# Altium schematic sheet rs485.SchDoc
size D
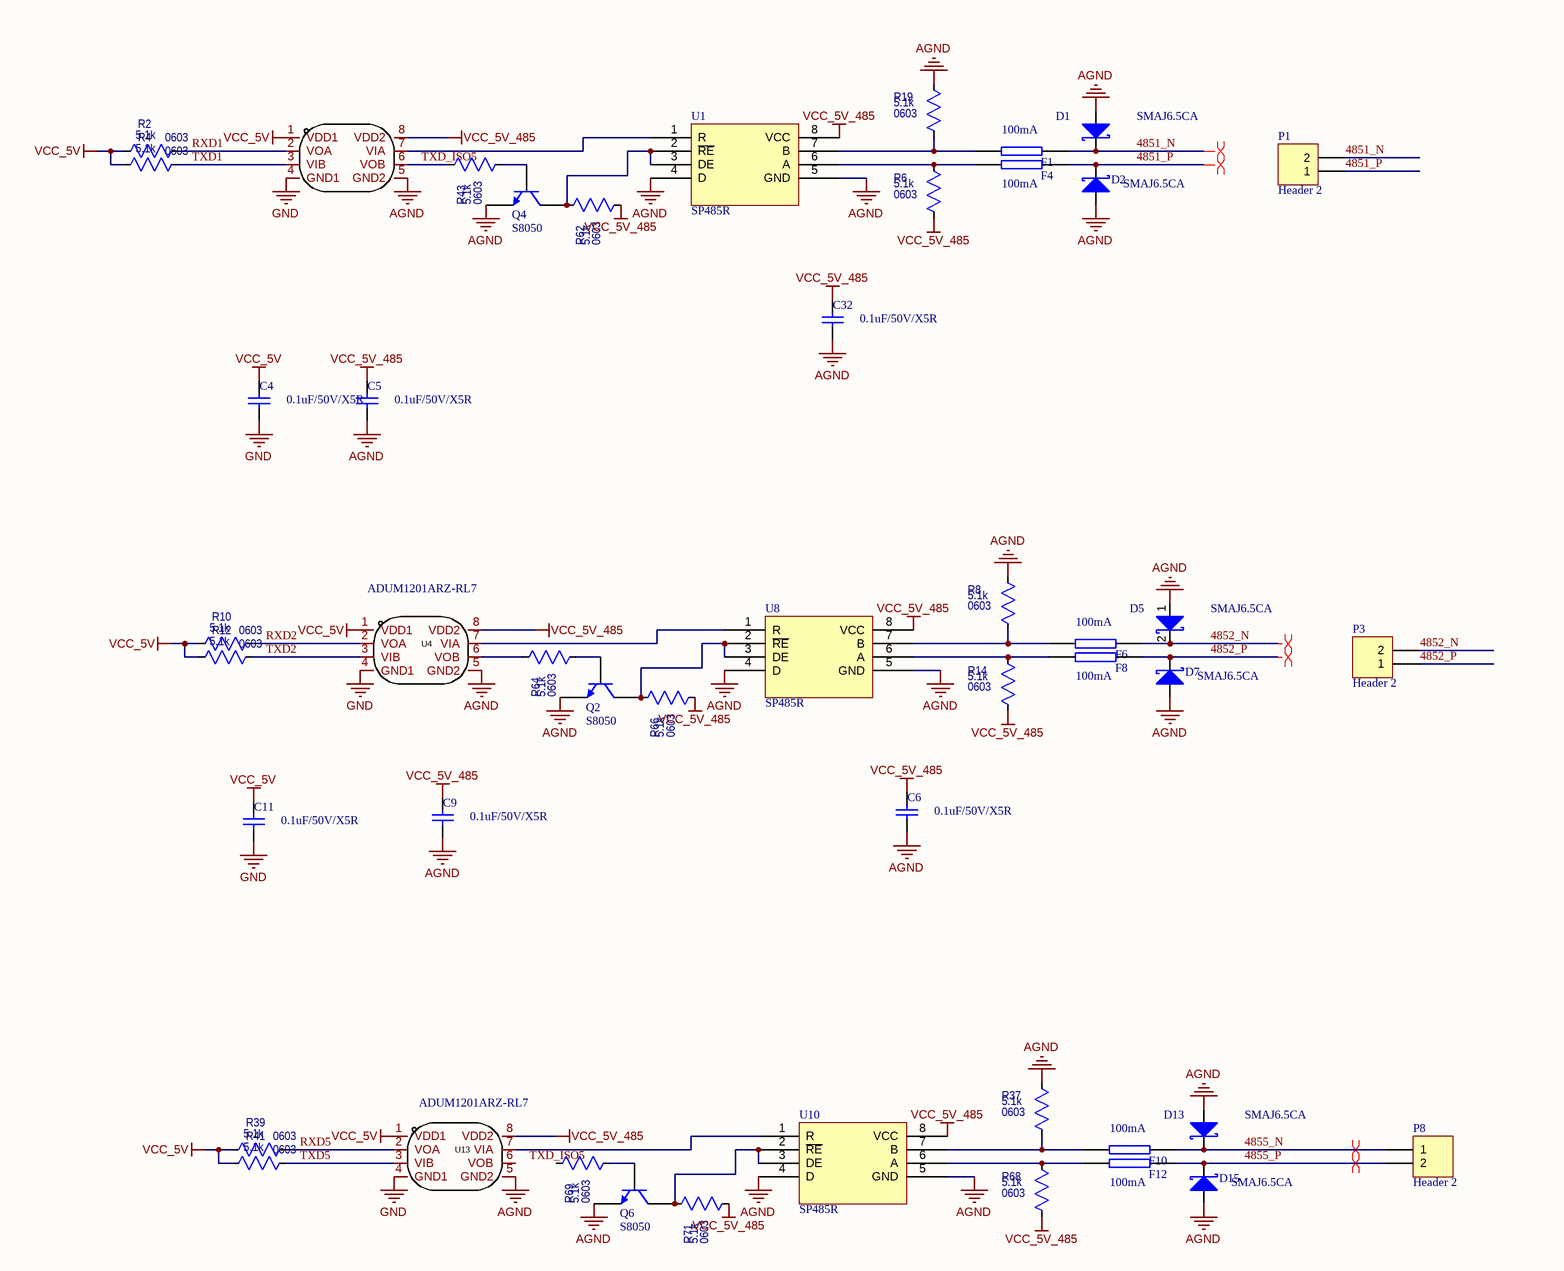
[diagram p0: rs485.SchDoc, top left]
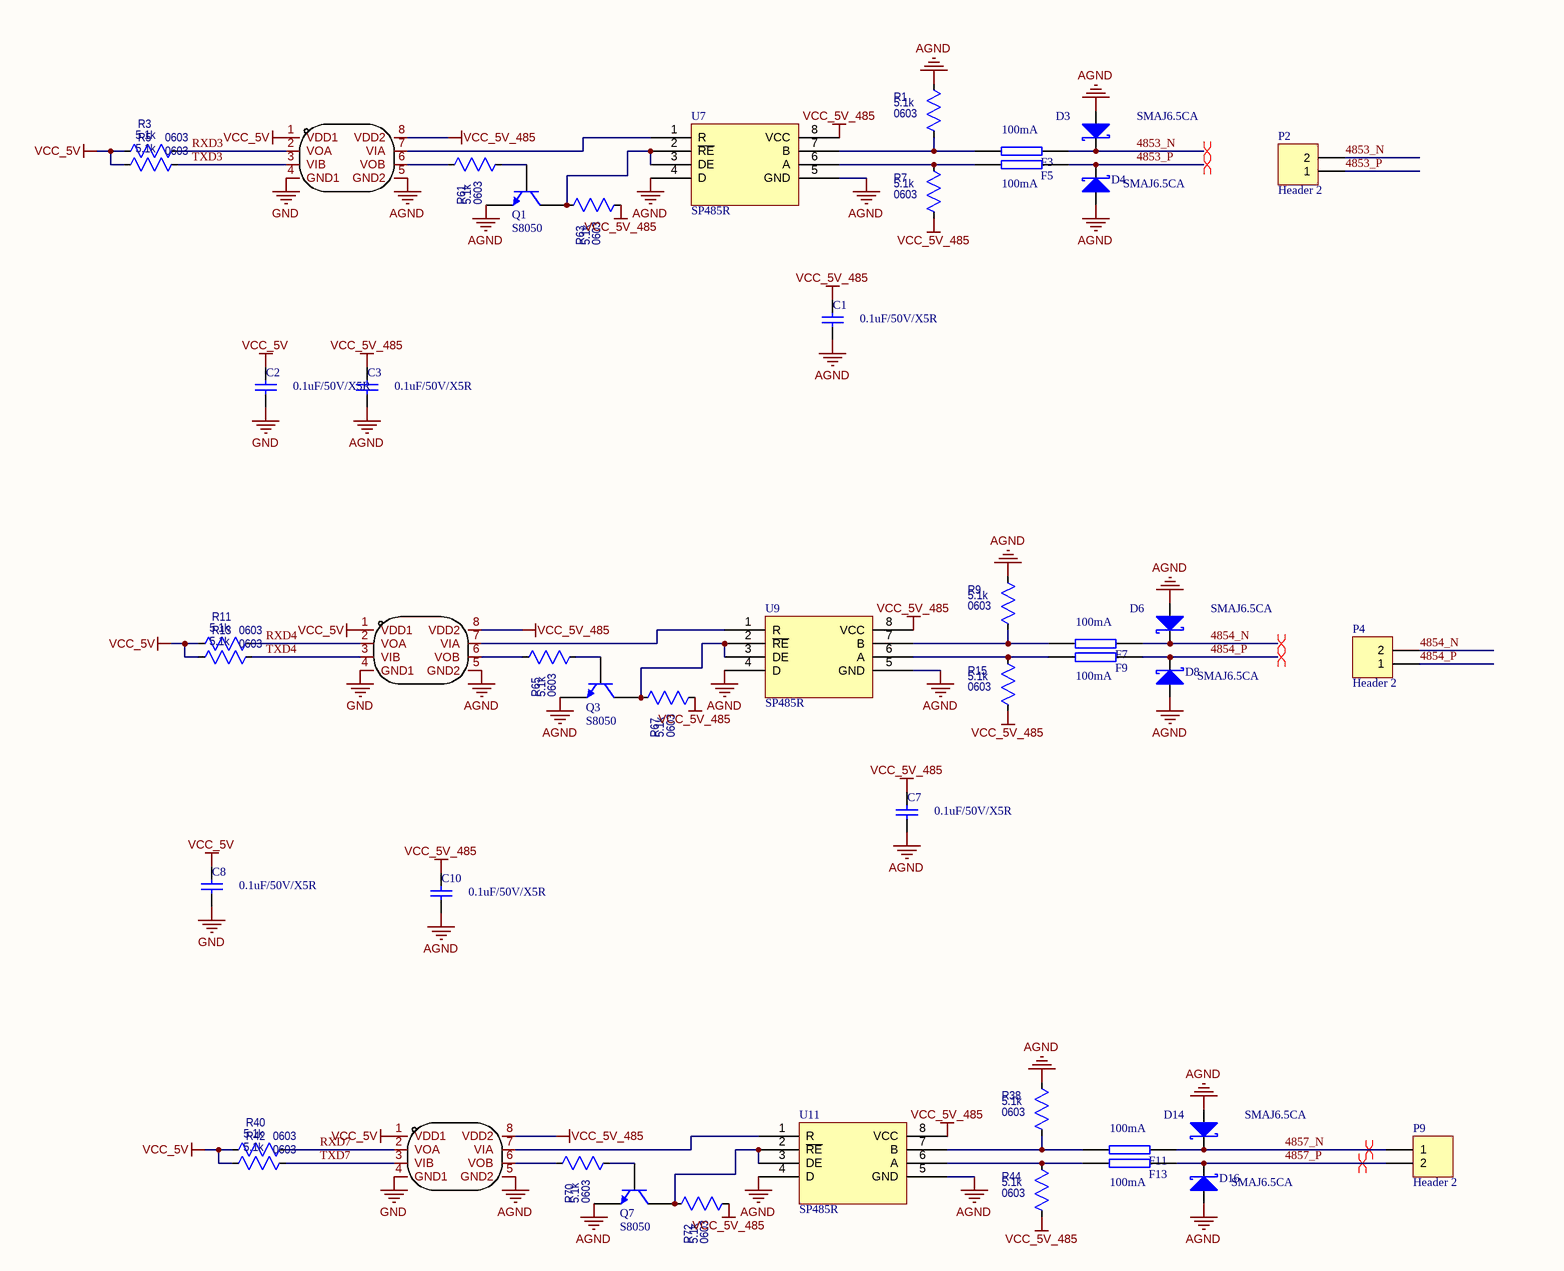
[diagram p1: rs485.SchDoc, top right]
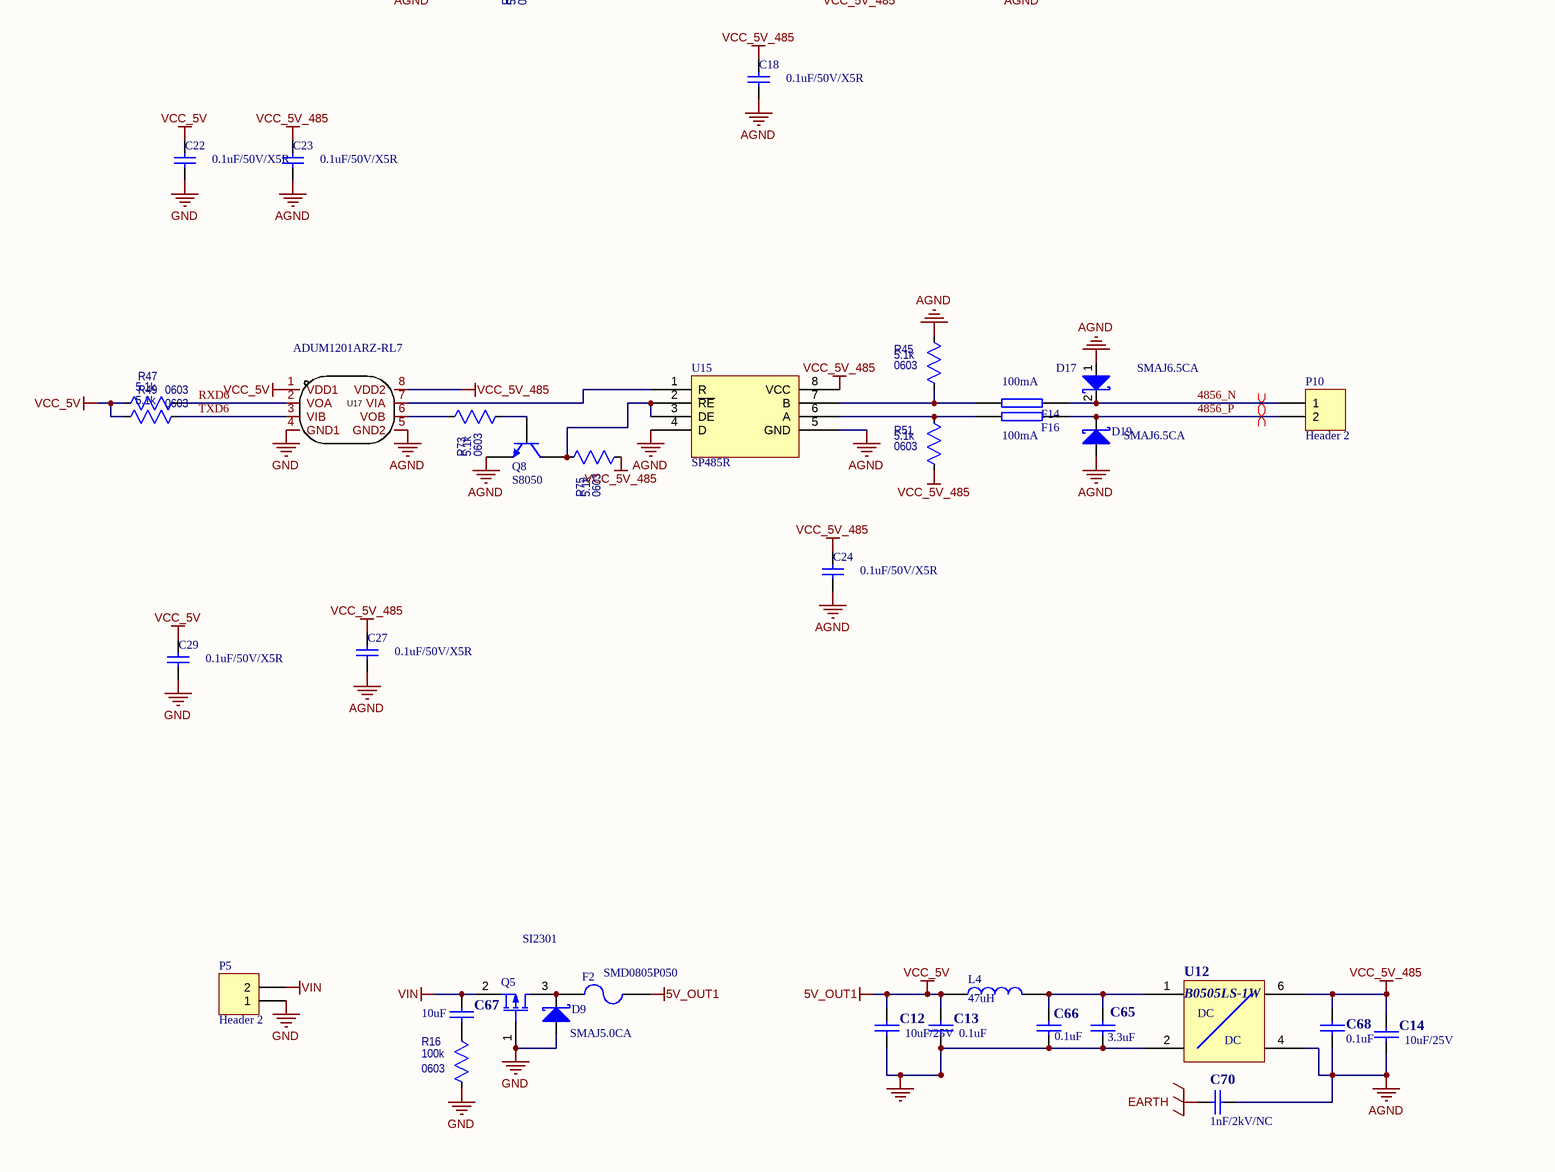
[diagram p2: rs485.SchDoc, bottom left]
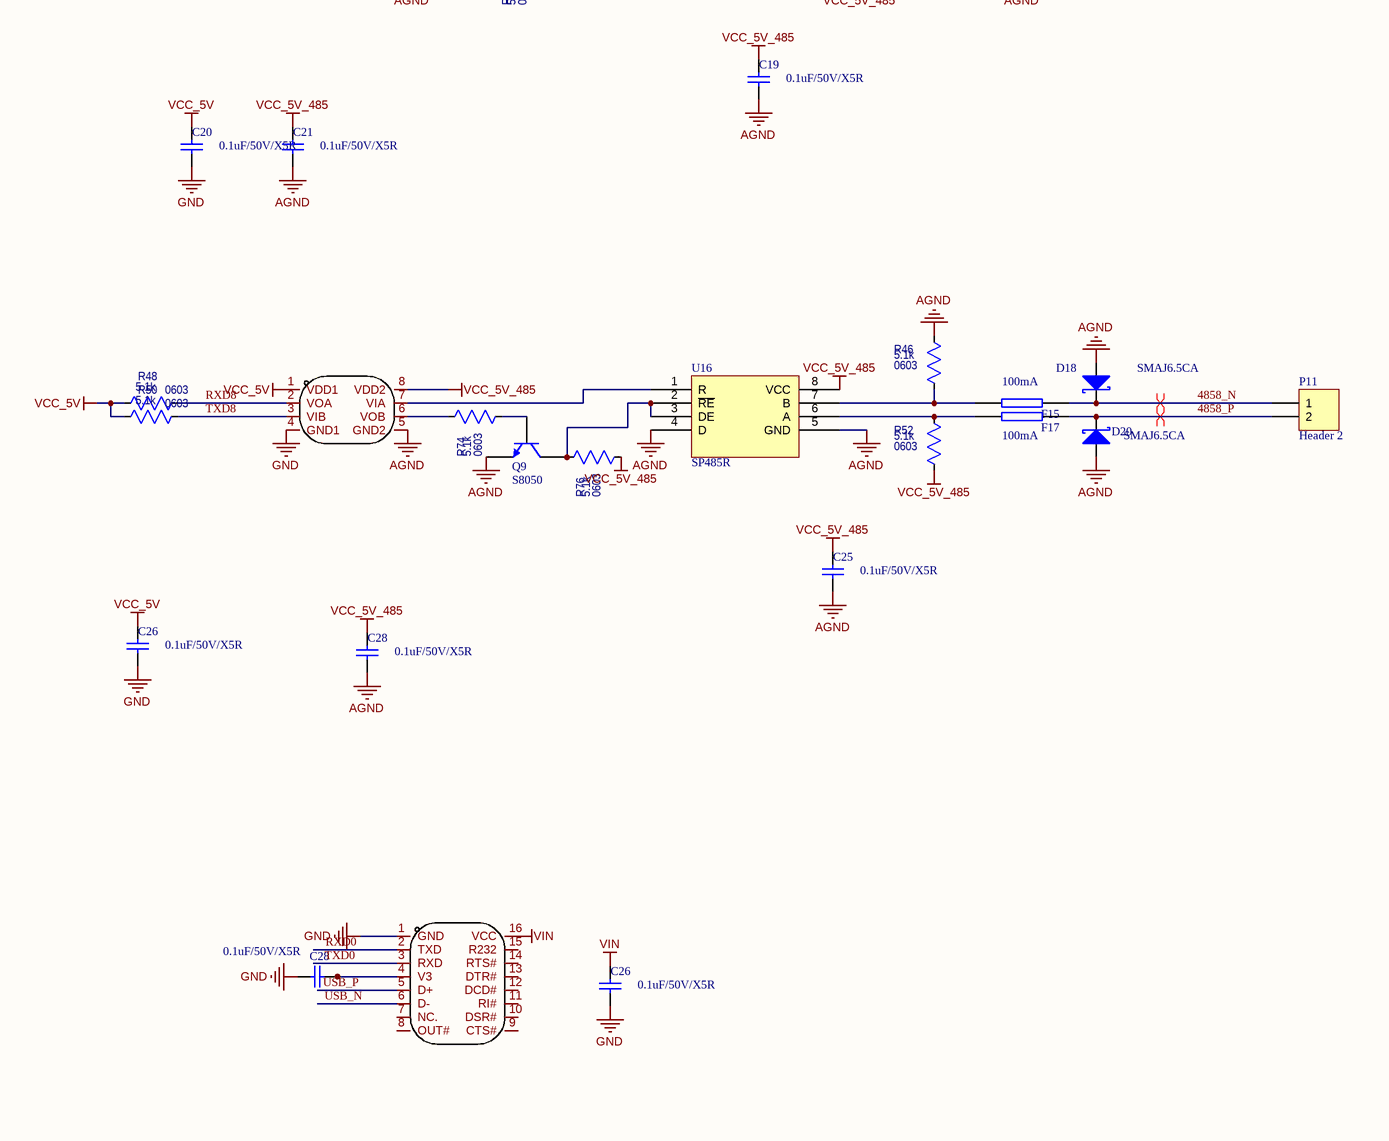
[diagram p3: rs485.SchDoc, bottom right]

## Parts
(Parts that share a designator on the sheet are numbered #1, #2 ... from top to bottom, then left to right.)
C1  0.1uF/50V/X5R  [0603C]
C2  0.1uF/50V/X5R  [0603C]
C3  0.1uF/50V/X5R  [0603C]
C4  0.1uF/50V/X5R  [0603C]
C5  0.1uF/50V/X5R  [0603C]
C6  0.1uF/50V/X5R  [0603C]
C7  0.1uF/50V/X5R  [0603C]
C8  0.1uF/50V/X5R  [0603C]
C9  0.1uF/50V/X5R  [0603C]
C10  0.1uF/50V/X5R  [0603C]
C11  0.1uF/50V/X5R  [0603C]
C12  10uF/25V  [0805C]
C13  0.1uF  [0603C]
C14  10uF/25V  [0805C]
C18  0.1uF/50V/X5R  [0603C]
C19  0.1uF/50V/X5R  [0603C]
C20  0.1uF/50V/X5R  [0603C]
C21  0.1uF/50V/X5R  [0603C]
C22  0.1uF/50V/X5R  [0603C]
C23  0.1uF/50V/X5R  [0603C]
C24  0.1uF/50V/X5R  [0603C]
C25  0.1uF/50V/X5R  [0603C]
C26#1  0.1uF/50V/X5R  [0603C]
C26#2  0.1uF/50V/X5R  [0603C]
C27  0.1uF/50V/X5R  [0603C]
C28#1  0.1uF/50V/X5R  [0603C]
C28#2  0.1uF/50V/X5R  [0603C]
C29  0.1uF/50V/X5R  [0603C]
C32  0.1uF/50V/X5R  [0603C]
C65  3.3uF  [0805C]
C66  0.1uF  [0603C]
C67  10uF  [0603C]
C68  0.1uF  [0603C]
C70  1nF/2kV/NC  [1206C]
D1  SMAJ6.5CA  [SMA]
D2  SMAJ6.5CA  [SMA]
D3  SMAJ6.5CA  [SMA]
D4  SMAJ6.5CA  [SMA]
D5  SMAJ6.5CA  [SMA]
D6  SMAJ6.5CA  [SMA]
D7  SMAJ6.5CA  [SMA]
D8  SMAJ6.5CA  [SMA]
D9  SMAJ5.0CA  [SMA]
D13  SMAJ6.5CA  [SMA]
D14  SMAJ6.5CA  [SMA]
D15  SMAJ6.5CA  [SMA]
D16  SMAJ6.5CA  [SMA]
D17  SMAJ6.5CA  [SMA]
D18  SMAJ6.5CA  [SMA]
D19  SMAJ6.5CA  [SMA]
D20  SMAJ6.5CA  [SMA]
F1  100mA  [0805R]
F2  SMD0805P050  [0805R]
F3  100mA  [0805R]
F4  100mA  [0805R]
F5  100mA  [0805R]
F6  100mA  [0805R]
F7  100mA  [0805R]
F8  100mA  [0805R]
F9  100mA  [0805R]
F10  100mA  [0805R]
F11  100mA  [0805R]
F12  100mA  [0805R]
F13  100mA  [0805R]
F14  100mA  [0805R]
F15  100mA  [0805R]
F16  100mA  [0805R]
F17  100mA  [0805R]
L4  47uH  [IND-SMD_L7.0-W6.6_FXL0630]
P1  Header 2  [HDR1X2]
P2  Header 2  [HDR1X2]
P3  Header 2  [HDR1X2]
P4  Header 2  [HDR1X2]
P5  Header 2  [HDR1X2]
P8  Header 2  [HDR1X2]
P9  Header 2  [HDR1X2]
P10  Header 2  [HDR1X2]
P11  Header 2  [HDR1X2]
Q1  S8050  [SOT23-3]
Q2  S8050  [SOT23-3]
Q3  S8050  [SOT23-3]
Q4  S8050  [SOT23-3]
Q5  SI2301  [sot23-3]
Q6  S8050  [SOT23-3]
Q7  S8050  [SOT23-3]
Q8  S8050  [SOT23-3]
Q9  S8050  [SOT23-3]
R1  value 5.1k  Package: 0603  [0603r]  (hidden comment: 10k)
R2  value 5.1k  Package: 0603  [0603r]  (hidden comment: 10k)
R3  value 5.1k  Package: 0603  [0603r]  (hidden comment: 10k)
R4  value 5.1k  Package: 0603  [0603r]  (hidden comment: 10k)
R5  value 5.1k  Package: 0603  [0603r]  (hidden comment: 10k)
R6  value 5.1k  Package: 0603  [0603r]  (hidden comment: 10k)
R7  value 5.1k  Package: 0603  [0603r]  (hidden comment: 10k)
R8  value 5.1k  Package: 0603  [0603r]  (hidden comment: 10k)
R9  value 5.1k  Package: 0603  [0603r]  (hidden comment: 10k)
R10  value 5.1k  Package: 0603  [0603r]  (hidden comment: 10k)
R11  value 5.1k  Package: 0603  [0603r]  (hidden comment: 10k)
R12  value 5.1k  Package: 0603  [0603r]  (hidden comment: 10k)
R13  value 5.1k  Package: 0603  [0603r]  (hidden comment: 10k)
R14  value 5.1k  Package: 0603  [0603r]  (hidden comment: 10k)
R15  value 5.1k  Package: 0603  [0603r]  (hidden comment: 10k)
R16  value 100k  Package: 0603  [0603r]  (hidden comment: 10k)
R19  value 5.1k  Package: 0603  [0603r]  (hidden comment: 10k)
R37  value 5.1k  Package: 0603  [0603r]  (hidden comment: 10k)
R38  value 5.1k  Package: 0603  [0603r]  (hidden comment: 10k)
R39  value 5.1k  Package: 0603  [0603r]  (hidden comment: 10k)
R40  value 5.1k  Package: 0603  [0603r]  (hidden comment: 10k)
R41  value 5.1k  Package: 0603  [0603r]  (hidden comment: 10k)
R42  value 5.1k  Package: 0603  [0603r]  (hidden comment: 10k)
R43  value 5.1k  Package: 0603  [0603r]  (hidden comment: 10k)
R44  value 5.1k  Package: 0603  [0603r]  (hidden comment: 10k)
R45  value 5.1k  Package: 0603  [0603r]  (hidden comment: 10k)
R46  value 5.1k  Package: 0603  [0603r]  (hidden comment: 10k)
R47  value 5.1k  Package: 0603  [0603r]  (hidden comment: 10k)
R48  value 5.1k  Package: 0603  [0603r]  (hidden comment: 10k)
R49  value 5.1k  Package: 0603  [0603r]  (hidden comment: 10k)
R50  value 5.1k  Package: 0603  [0603r]  (hidden comment: 10k)
R51  value 5.1k  Package: 0603  [0603r]  (hidden comment: 10k)
R52  value 5.1k  Package: 0603  [0603r]  (hidden comment: 10k)
R61  value 5.1k  Package: 0603  [0603r]  (hidden comment: 10k)
R62  value 5.1k  Package: 0603  [0603r]  (hidden comment: 10k)
R63  value 5.1k  Package: 0603  [0603r]  (hidden comment: 10k)
R64  value 5.1k  Package: 0603  [0603r]  (hidden comment: 10k)
R65  value 5.1k  Package: 0603  [0603r]  (hidden comment: 10k)
R66  value 5.1k  Package: 0603  [0603r]  (hidden comment: 10k)
R67  value 5.1k  Package: 0603  [0603r]  (hidden comment: 10k)
R68  value 5.1k  Package: 0603  [0603r]  (hidden comment: 10k)
R69  value 5.1k  Package: 0603  [0603r]  (hidden comment: 10k)
R70  value 5.1k  Package: 0603  [0603r]  (hidden comment: 10k)
R71  value 5.1k  Package: 0603  [0603r]  (hidden comment: 10k)
R72  value 5.1k  Package: 0603  [0603r]  (hidden comment: 10k)
R73  value 5.1k  Package: 0603  [0603r]  (hidden comment: 10k)
R74  value 5.1k  Package: 0603  [0603r]  (hidden comment: 10k)
R75  value 5.1k  Package: 0603  [0603r]  (hidden comment: 10k)
R76  value 5.1k  Package: 0603  [0603r]  (hidden comment: 10k)
U1  SP485R  [so-8]
U2  ADUM1201ARZ-RL7  [SO8]  (value not drawn)
U3  ADUM1201ARZ-RL7  [SO-8]  (value not drawn)
U4  ADUM1201ARZ-RL7  [SO-8]
U5  ADUM1201ARZ-RL7  [SO-8]  (value not drawn)
U7  SP485R  [so-8]
U8  SP485R  [so-8]
U9  SP485R  [so-8]
U10  SP485R  [so-8]
U11  SP485R  [so-8]
U12  B0505LS-1W  [PWRM-TH_4P-L19.7-W6.0-P2.54]
U13  ADUM1201ARZ-RL7  [SO-8]
U14  ADUM1201ARZ-RL7  [SO-8]  (value not drawn)
U15  SP485R  [so-8]
U16  SP485R  [so-8]
U17  ADUM1201ARZ-RL7  [SO-8]
U18  ADUM1201ARZ-RL7  [SO-8]  (value not drawn)
U?  CH340C  [SOP-16_L10.0-W3.9-P1.27-LS6.0-BL]  (value not drawn)

## Nets
5V_OUT1: C2.2 C4.2 C8.2 C11.2 C12.1 C13.1 C20.2 C22.2 C26#1.2 C29.2 F2.2 L4.1 R2.1 R3.1 R4.1 R5.1 R10.1 R11.1 R12.1 R13.1 R39.1 R40.1 R41.1 R42.1 R47.1 R48.1 R49.1 R50.1 U2.1(VDD1) U3.1(VDD1) U4.1(VDD1) U5.1(VDD1) U13.1(VDD1) U14.1(VDD1) U17.1(VDD1) U18.1(VDD1)  [also labelled VCC_5V]
AGND: C1.1 C3.1 C5.1 C6.1 C7.1 C9.1 C10.1 C14.2 C18.1 C19.1 C21.1 C23.1 C24.1 C25.1 C27.1 C28#1.1 C32.1 C68.2 C70.1 D1.1(A) D2.1(A) D3.1(A) D4.1(A) D5.1(A) D6.1(A) D7.1(A) D8.1(A) D13.1(A) D14.1(A) D15.1(A) D16.1(A) D17.1(A) D18.1(A) D19.1(A) D20.1(A) Q1.2(E) Q2.2(E) Q3.2(E) Q4.2(E) Q6.2(E) Q7.2(E) Q8.2(E) Q9.2(E) R1.1 R8.1 R9.1 R19.1 R37.1 R38.1 R45.1 R46.1 U1.4(D) U1.5(GND) U2.5(GND2) U3.5(GND2) U4.5(GND2) U5.5(GND2) U7.4(D) U7.5(GND) U8.4(D) U8.5(GND) U9.4(D) U9.5(GND) U10.4(D) U10.5(GND) U11.4(D) U11.5(GND) U12.4 U13.5(GND2) U14.5(GND2) U15.4(D) U15.5(GND) U16.4(D) U16.5(GND) U17.5(GND2) U18.5(GND2)
EARTH: C70.2
GND: C2.1 C4.1 C8.1 C11.1 C12.2 C13.2 C20.1 C22.1 C26#1.1 C26#2.1 C28#2.2 C29.1 C65.2 C66.2 D9.1(A) P5.1 Q5.1(G) R16.2 U2.4(GND1) U3.4(GND1) U4.4(GND1) U5.4(GND1) U12.2 U13.4(GND1) U14.4(GND1) U17.4(GND1) U18.4(GND1) U?.1(GND)
VCC_5V_485: C1.2 C3.2 C5.2 C6.2 C7.2 C9.2 C10.2 C14.1 C18.2 C19.2 C21.2 C23.2 C24.2 C25.2 C27.2 C28#1.2 C32.2 C68.1 R6.2 R7.2 R14.2 R15.2 R44.2 R51.2 R52.2 R62.2 R63.2 R66.2 R67.2 R68.2 R71.2 R72.2 R75.2 R76.2 U1.8(VCC) U2.8(VDD2) U3.8(VDD2) U4.8(VDD2) U5.8(VDD2) U7.8(VCC) U8.8(VCC) U9.8(VCC) U10.8(VCC) U11.8(VCC) U12.6 U13.8(VDD2) U14.8(VDD2) U15.8(VCC) U16.8(VCC) U17.8(VDD2) U18.8(VDD2)
VIN: C26#2.2 C67.1 P5.2 Q5.2(S) U?.16(VCC)
4851_N: D1.2(K) F1.1 P1.2
4851_P: D2.2(K) F4.1 P1.1
4852_N: D5.2(K) F6.1 P3.2
4852_P: D7.2(K) F8.1 P3.1
4853_N: D3.2(K) F3.1 P2.2
4853_P: D4.2(K) F5.1 P2.1
4854_N: D6.2(K) F7.1 P4.2
4854_P: D8.2(K) F9.1 P4.1
4855_N: D13.2(K) F10.1 P8.1
4855_P: D15.2(K) F12.1 P8.2
4856_N: D17.2(K) F14.1 P10.1
4856_P: D19.2(K) F16.1 P10.2
4857_N: D14.2(K) F11.1 P9.1
4857_P: D16.2(K) F13.1 P9.2
4858_N: D18.2(K) F15.1 P11.1
4858_P: D20.2(K) F17.1 P11.2
RXD0: U?.2(TXD)
RXD1: R2.2 U2.2(VOA)
RXD2: R10.2 U4.2(VOA)
RXD3: R3.2 U3.2(VOA)
RXD4: R11.2 U5.2(VOA)
RXD5: R39.2 U13.2(VOA)
RXD6: R47.2 U17.2(VOA)
RXD7: R40.2 U14.2(VOA)
RXD8: R48.2 U18.2(VOA)
TXD0: U?.3(RXD)
TXD1: R4.2 U2.3(VIB)
TXD2: R12.2 U4.3(VIB)
TXD3: R5.2 U3.3(VIB)
TXD4: R13.2 U5.3(VIB)
TXD5: R41.2 U13.3(VIB)
TXD6: R49.2 U17.3(VIB)
TXD7: R42.2 U14.3(VIB)
TXD8: R50.2 U18.3(VIB)
TXD_ISO5: R43.1 U2.6(VOB)
USB_N: U?.6(D-)
USB_P: U?.5(D+)
NetC28#2_1: C28#2.1 U?.4(V3)
NetC65_1: C65.1 C66.1 L4.2 U12.1
NetC67_2: C67.2 R16.1
NetD9_2: D9.2(K) F2.1 Q5.3(D)
NetF1_2: F1.2 R19.2 U1.7(B)
NetF3_2: F3.2 R1.2 U7.7(B)
NetF4_2: F4.2 R6.1 U1.6(A)
NetF5_2: F5.2 R7.1 U7.6(A)
NetF6_2: F6.2 R8.2 U8.7(B)
NetF7_2: F7.2 R9.2 U9.7(B)
NetF8_2: F8.2 R14.1 U8.6(A)
NetF9_2: F9.2 R15.1 U9.6(A)
NetF10_2: F10.2 R37.2 U10.7(B)
NetF11_2: F11.2 R38.2 U11.7(B)
NetF12_2: F12.2 R68.1 U10.6(A)
NetF13_2: F13.2 R44.1 U11.6(A)
NetF14_2: F14.2 R45.2 U15.7(B)
NetF15_2: F15.2 R46.2 U16.7(B)
NetF16_2: F16.2 R51.1 U15.6(A)
NetF17_2: F17.2 R52.1 U16.6(A)
NetQ1_1: Q1.1(B) R61.2
NetQ1_3: Q1.3(C) R63.1 U7.2(~{RE}) U7.3(DE)
NetQ2_1: Q2.1(B) R64.2
NetQ2_3: Q2.3(C) R66.1 U8.2(~{RE}) U8.3(DE)
NetQ3_1: Q3.1(B) R65.2
NetQ3_3: Q3.3(C) R67.1 U9.2(~{RE}) U9.3(DE)
NetQ4_1: Q4.1(B) R43.2
NetQ4_3: Q4.3(C) R62.1 U1.2(~{RE}) U1.3(DE)
NetQ6_1: Q6.1(B) R69.2
NetQ6_3: Q6.3(C) R71.1 U10.2(~{RE}) U10.3(DE)
NetQ7_1: Q7.1(B) R70.2
NetQ7_3: Q7.3(C) R72.1 U11.2(~{RE}) U11.3(DE)
NetQ8_1: Q8.1(B) R73.2
NetQ8_3: Q8.3(C) R75.1 U15.2(~{RE}) U15.3(DE)
NetQ9_1: Q9.1(B) R74.2
NetQ9_3: Q9.3(C) R76.1 U16.2(~{RE}) U16.3(DE)
NetR61_1: R61.1 U3.6(VOB)
NetR64_1: R64.1 U4.6(VOB)
NetR65_1: R65.1 U5.6(VOB)
NetR70_1: R70.1 U14.6(VOB)
NetR73_1: R73.1 U17.6(VOB)
NetR74_1: R74.1 U18.6(VOB)
NetU1_1: U1.1(R) U2.7(VIA)
NetU3_7: U3.7(VIA) U7.1(R)
NetU4_7: U4.7(VIA) U8.1(R)
NetU5_7: U5.7(VIA) U9.1(R)
NetU10_1: U10.1(R) U13.7(VIA)
NetU11_1: U11.1(R) U14.7(VIA)
NetU15_1: U15.1(R) U17.7(VIA)
NetU16_1: U16.1(R) U18.7(VIA)

Not connected (* = marked no-connect by the designer): R69 1; U13 6(VOB); U? 7(NC.) 8(OUT#) 9(CTS#) 10(DSR#) 11(RI#) 12(DCD#) 13(DTR#) 14(RTS#) 15(R232)

## Layout directives
differential pair: 4851_N, 4851_P, 4852_N, 4852_P, 4853_N, 4853_P, 4854_N, 4854_P, 4855_N, 4855_P, 4856_N, 4856_P, 4857_N, 4857_P, 4858_N, 4858_P

## Notes on the sheet
- Labels drawn without touching a wire or pin: TXD_ISO5
- DWG. NO.
- REV.
- SHT.
- REVISION
- DESCRIPTION
- DATE
- APPROVED
- THIS DOCUMENT AND THE DATA DISCLOSED HEREIN OR HEREWITH IS THE PROPERTY OF ALTIUM LIMITED AND MAY BE FREELY DISTRIBUTED IN WHOLE. NO RIGHTS ARE RESERVED OR EXPRESS OR IMPLIED WARANTEE GIVEN.
- ENG:
- DSN:
- APPROVALS
- PROJECT
- DOCUMENT REVISION:
- DESIGN ITEM:
- CHK:
- BOM:
- REFERENCE DOCUMENTS
- PROJECT REVISION:
- TITLE
- FAB DWG:
- PCB DWG:
- ASSY DWG:
- SCALE:
- SIZE
- C
- CAGE CODE
- FILE NAME
- DWG NO.
- SHEET
- OF
- REV
- (in symbol B0505S) DC

## Library data of the parts
C1-C11 C18-C25 C26#1 C26#2 C27 C28#1 C28#2 C29 C32 = CAP4: 贴片电容 20%
C12-C14 C65-C68 C70 = CAP: Capacitor
D1-D9 D13-D20 = DIODE S: Schottky Diode
F1 F3-F17 = RES2
F2 = Fuse 2: Fuse; Published: 8-Jun-2000; LatestRevisionDate: 17-Jul-2002; LatestRevisionNote: Re-released for DXP Platform.; PackageReference: PIN-W2/E2.8; Publisher: Altium Limited
L4 = INDUCTOR
P1-P5 P8-P11 = Header 2: Header, 2-Pin; LatestRevisionDate: 17-Jul-2002; LatestRevisionNote: Re-released for DXP Platform.; Publisher: Altium Limited
Q1-Q4 Q6-Q9 = NPN: NPN Bipolar Transistor; Published: 8-Jun-2000; LatestRevisionDate: 17-Jul-2002; LatestRevisionNote: Re-released for DXP Platform.; PackageReference: TO-226; Publisher: Altium Limited; Code_JEDEC: TO-226-AA
Q5 = MOSFET-P: P-Channel MOSFET; Published: 8-Jun-2000; LatestRevisionDate: 17-Jul-2002; LatestRevisionNote: Re-released for DXP Platform.; PackageVersion: 1995/1996; PackageReference: E3; Publisher: Altium Limited
R1-R16 R19 R37-R52 R61-R76 = Resistor_0603: PartNumber: RC0603FR-071KL; Power Rating: [power]; TempCo: [tempco]; Tolerance: tol; SupplierDescription: RES SMD 1K OHM 1% 1/10W 0603
U1 U7-U11 U15 U16 = SN65HVD06D
U2-U5 U13 U14 U17 U18 = ADUM1201ARZ-RL7: Add into BOM: yes; Supply Voltage: 2.7V~5.5V; Data Rate: 1Mbps; Number of Channels: 2; Isolation voltage: 2500Vrms; Forward Channel: 1; Symbol: ADUM1201ARZ-RL7; Device: ADUM1201ARZ-RL7; Supplier Part: C9669; Manufacturer Part: ADUM1201ARZ-RL7; Supplier Footprint: SOIC-8; JLCPCB Part Class: Extended Part; Datasheet: https://atta.szlcsc.com/upload/public/pdf/source/20121103/1457706544769.pdf; Supplier: LCSC; Convert to PCB: yes; Reverse channel: 1
U12 = B0505S
U? = CH340C: Add into BOM: yes; Protocol: USB 2.0; Data Rate: 2Mbps; Symbol: CH340C; Device: CH340C; Supplier: LCSC; Manufacturer Part: CH340C; Supplier Part: C84681; JLCPCB Part Class: Extended Part; Supplier Footprint: SOP-16; Datasheet: https://atta.szlcsc.com/upload/public/pdf/source/20200819/C84681_ADBED554CE321879DBD6B1D06488689C.pdf; Convert to PCB: yes